# EAGLE schematic ParticlePCB (EAGLE 9.3.0)
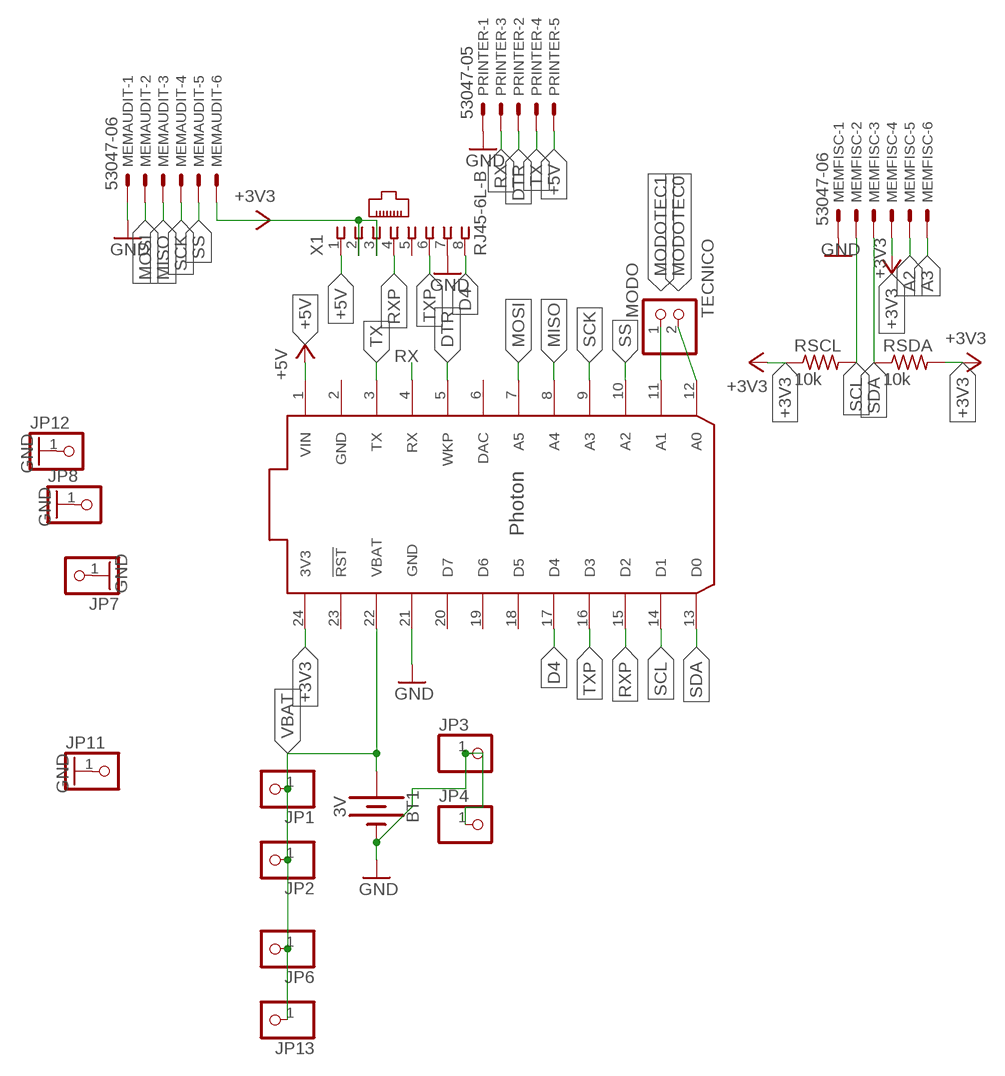
[diagram p0: schematic, sheet 1]

## Parts
BT1  3V  BATTERY-12MM_PTH  [BATTCON_12MM_PTH]
JP1  PINHD-1X1CB  [1X01-CLEANBIG]
JP2  PINHD-1X1CB  [1X01-CLEANBIG]
JP3  PINHD-1X1CB  [1X01-CLEANBIG]
JP4  PINHD-1X1CB  [1X01-CLEANBIG]
JP6  PINHD-1X1CB  [1X01-CLEANBIG]
JP7  PINHD-1X1CB  [1X01-CLEANBIG]
JP8  PINHD-1X1CB  [1X01-CLEANBIG]
JP11  PINHD-1X1CB  [1X01-CLEANBIG]
JP12  PINHD-1X1CB  [1X01-CLEANBIG]
JP13  PINHD-1X1CB  [1X01-CLEANBIG]
MEMAUDIT  53047-06  [53047-06]
MEMFISC  53047-06  [53047-06]
MODO  TECNICO  PINHD-1X2  [1X02]
PRINTER  53047-05  [53047-05]
RSCL  10k  R-US_0207/10  [0207/10]
RSDA  10k  R-US_0207/10  [0207/10]
U$2  PHOTON_WITH_HEADERS  [PHOTON]
X1  RJ45-6L-B  [RJ45-NO-SHIELD]

## Nets
+3V3: MEMAUDIT.6 MEMFISC.4 RSCL.1 RSDA.2 U$2.24(3V3) X1.2 X1.3
+5V: PRINTER.5 U$2.1(VIN) X1.1
A2: MEMFISC.5
A3: MEMFISC.6
D4: U$2.17(D4) X1.8
DTR: PRINTER.2 U$2.5(WKP)
GND: BT1.GND(-) JP3.1 JP4.1 JP7.1 JP8.1 JP11.1 JP12.1 MEMAUDIT.1 MEMFISC.1 PRINTER.1 U$2.21(GND) X1.7
MISO: MEMAUDIT.3 U$2.8(A4)
MODOTEC0: MODO.2 U$2.12(A0)
MODOTEC1: MODO.1 U$2.11(A1)
MOSI: MEMAUDIT.2 U$2.7(A5)
RX: PRINTER.3 U$2.4(RX)
RXP: U$2.15(D2) X1.4
SCK: MEMAUDIT.4 U$2.9(A3)
SCL: MEMFISC.2 RSCL.2 U$2.14(D1)
SDA: MEMFISC.3 RSDA.1 U$2.13(D0)
SS: MEMAUDIT.5 U$2.10(A2)
TX: PRINTER.4 U$2.3(TX)
TXP: U$2.16(D3) X1.6
VBAT: BT1.VCC@1(+) JP1.1 JP2.1 JP6.1 JP13.1 U$2.22(VBAT)
Unconnected: U$2.6(DAC) U$2.18(D5) U$2.19(D6) U$2.20(D7) U$2.23(!RST) X1.5

## Power pins joined to a net without a drawn wire
GND: U$2.2(GND)

## Library data of the parts
BT1 = SparkFun-Batteries:BATTERY: Battery - Single Cell A variety of battery chemistries, sizes, and footprints. Device List: 20MM_PTH - Coin Cell Battery Holder - 20mm (PTH) <https://www.sparkfun.com/products/783> 6.8MM_PTH - Coin Cell Battery Holder - 6.8MM(SMD) <https://www.digikey.com/product-detail/en/seiko-instruments/MS621FE-FL11E/728-1057-ND/1889208?WT.srch=1&gclid=CNOQ5a6LzdQCFZS2wAodXCkE0g> 12MM_SMD - Coin Cell Battery Holder - 12mm (SMD) <https://www.sparkfun.com/products/10592> 12MM_PTH - Coin Cell Battery Holder - 12mm (PTH) <https://www.sparkfun.com/products/7948> 20MM_SMD - 20mm Coin Cell Battery Holder (SMD) (2 legs) Used on the Big Time Watch Kit <https://www.sparkfun.com/products/11734> 20MM_SMD_4LEGS - Coin Cell Battery Holder - 20mm (SMD) <https://www.sparkfun.com/products/11892> 20MM_SMD_4LEGS_OVERPASTE - Coin Cell Battery Holder - 20mm (SMD) <https://www.sparkfun.com/products/11892> (Over-paste on the legs) 24.5MM_PTH - Coin Cell Battery Holder - 24.5mm (PTH) <https://www.sparkfun.com/products/8863> 9V - 9V Battery Holder - PC Mount Used on the SparkFun SparkPunk Sound Kit <https://www.sparkfun.com/products/11177> and SparkFun SparkPunk Sequencer Kit <https://www.sparkfun.com/products/12707> 18650 - Battery Holder - 18650 (PTH) <https://www.sparkfun.com/products/13113> AA - Battery Holder - 1xAA (PTH) <https://www.sparkfun.com/products/7949> AAA - Battery Holder - 1xAAA (PTH) <https://www.sparkfun.com/products/12718> AA_KIT - Battery Holder - 1xAA (PTH) <https://www.sparkfun.com/products/7949> Special kit package - pads only have exposed copper on one side of the board. AAA_KIT - Battery Holder - 1xAAA (PTH) <https://www.sparkfun.com/products/12718> Special kit package - pads only have exposed copper on one side of the board.; PROD_ID: BATT-08315; SF_SKU: PRT-07948
JP1-JP4 JP6-JP8 JP11-JP13 = adafruit:PINHD-1X1: Pin header 1x1 for 0.1" spacing With round pins
MEMAUDIT MEMFISC = PNP:53?-06: CONNECTOR wire to board 1.25 mm (.049 inch) pitch header
MODO = pinhead:PINHD-1X2: PIN HEADER
PRINTER = PNP:53?-05: CONNECTOR wire to board 1.25 mm (.049 inch) pitch header
RSCL RSDA = rcl:R-US_: RESISTOR, American symbol; SPICEPREFIX: R
U$2 = Particle-Devices:PHOTON: Particle Photon Wi-Fi through-hole development board footprint Product datasheet: here <https://docs.particle.io/datasheets/photon-(wifi)/photon-datasheet/> Design files: here <https://github.com/particle-iot/photon> Github : Particle devices library <https://github.com/particle-iot/hardware-libraries/tree/master/Eagle>
X1 = con-tycoelectronics:RJ45: CORCOM Modular RJ Jacks No Shield Source: www.tycoelectronics.com .. ENG_DS_1654001_1099_RJ_L_0507.pdf; MPN: RJ45-6L-B; OC_FARNELL: unknown; OC_NEWARK: 16R6090